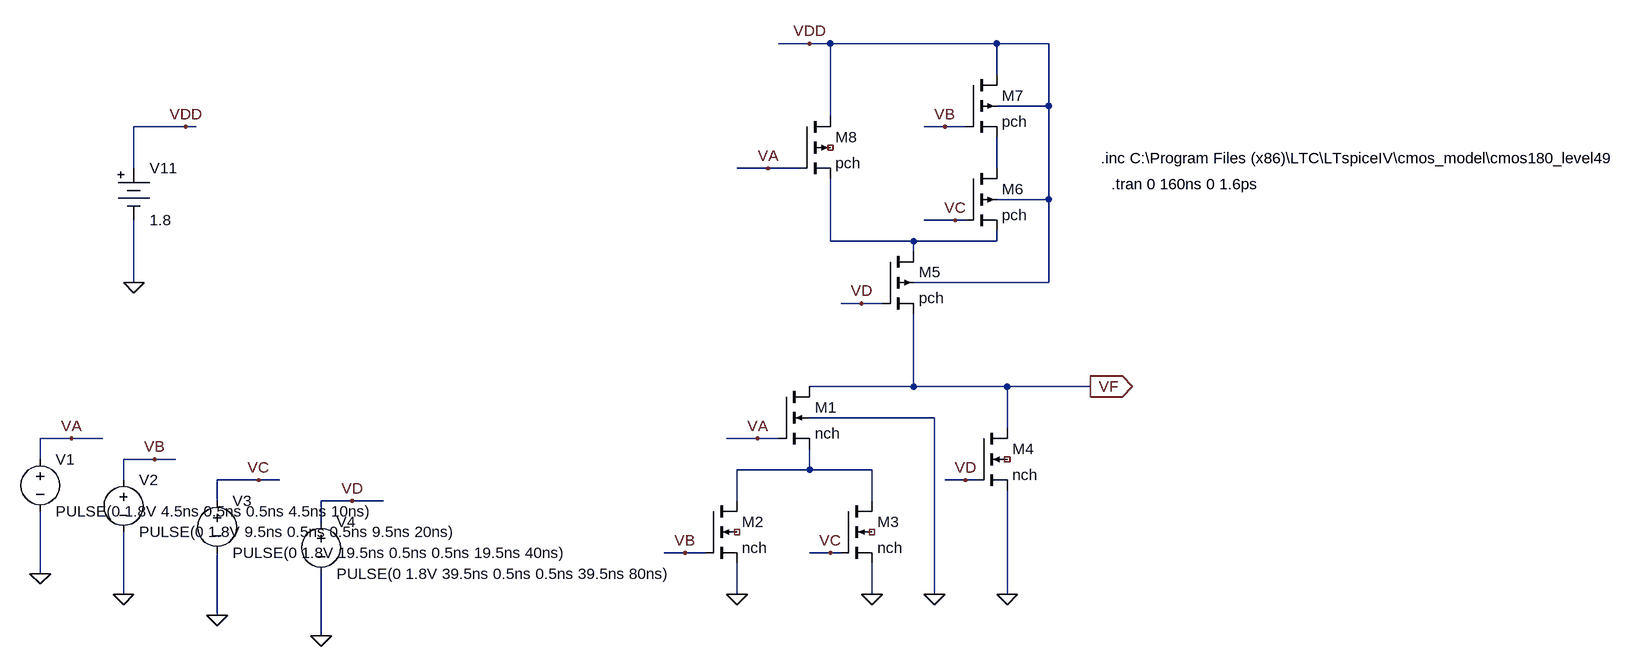
[diagram p0: schematic lab3.asc]
lab3.asc, the LTspice schematic file:
Version 4
SHEET 1 1628 948
WIRE 240 -192 192 -192
WIRE 272 -192 240 -192
WIRE 528 -192 272 -192
WIRE 608 -192 528 -192
WIRE 528 -144 528 -192
WIRE 608 -96 608 -192
WIRE 608 -96 528 -96
WIRE 272 -80 272 -192
WIRE -720 -64 -800 -64
WIRE -704 -64 -720 -64
WIRE 448 -64 416 -64
WIRE 480 -64 448 -64
WIRE -800 0 -800 -64
WIRE 176 0 128 0
WIRE 224 0 176 0
WIRE 528 0 528 -48
WIRE 608 48 608 -96
WIRE 608 48 528 48
WIRE 464 80 416 80
WIRE 480 80 464 80
WIRE 272 112 272 16
WIRE 400 112 272 112
WIRE 528 112 528 96
WIRE 528 112 400 112
WIRE 400 128 400 112
WIRE -800 176 -800 80
WIRE 608 176 608 48
WIRE 608 176 400 176
WIRE 320 208 288 208
WIRE 352 208 320 208
WIRE 400 336 400 224
WIRE 400 336 240 336
WIRE 544 336 400 336
WIRE 672 336 544 336
WIRE 432 384 240 384
WIRE 544 400 544 336
WIRE -896 416 -944 416
WIRE -848 416 -896 416
WIRE 160 416 112 416
WIRE 192 416 160 416
WIRE -944 448 -944 416
WIRE -768 448 -816 448
WIRE -736 448 -768 448
WIRE 240 464 240 432
WIRE 240 464 128 464
WIRE 336 464 240 464
WIRE -816 480 -816 448
WIRE -608 480 -672 480
WIRE -576 480 -608 480
WIRE 480 480 448 480
WIRE 496 480 480 480
WIRE -672 512 -672 480
WIRE -464 512 -512 512
WIRE -416 512 -464 512
WIRE 128 512 128 464
WIRE 336 512 336 464
WIRE -512 544 -512 512
WIRE 48 592 16 592
WIRE 80 592 48 592
WIRE 272 592 240 592
WIRE 288 592 272 592
WIRE -944 624 -944 528
WIRE -816 656 -816 560
WIRE 128 656 128 608
WIRE 336 656 336 608
WIRE 432 656 432 384
WIRE 544 656 544 496
WIRE -672 688 -672 592
WIRE -512 720 -512 624
FLAG 128 656 0
FLAG 336 656 0
FLAG 544 656 0
FLAG 240 -192 VDD
FLAG 672 336 VF
IOPIN 672 336 Out
FLAG -800 176 0
FLAG -720 -64 VDD
FLAG -896 416 VA
FLAG -768 448 VB
FLAG -608 480 VC
FLAG -464 512 VD
FLAG -944 624 0
FLAG -816 656 0
FLAG -672 688 0
FLAG 160 416 VA
FLAG 176 0 VA
FLAG 48 592 VB
FLAG 448 -64 VB
FLAG 464 80 VC
FLAG 272 592 VC
FLAG 480 480 VD
FLAG 320 208 VD
FLAG -512 720 0
FLAG 432 656 0
SYMBOL nmos4 192 336 R0
SYMATTR InstName M1
SYMATTR Value nch
SYMATTR Value2 l=0.18u w=4u
SYMBOL nmos4 80 512 R0
SYMATTR InstName M2
SYMATTR Value nch
SYMATTR Value2 l=0.18u w=4u
SYMBOL nmos4 288 512 R0
SYMATTR InstName M3
SYMATTR Value nch
SYMATTR Value2 l=0.18u w=4u
SYMBOL nmos4 496 400 R0
SYMATTR InstName M4
SYMATTR Value nch
SYMATTR Value2 l=0.18u w=4u
SYMBOL pmos4 352 128 R0
SYMATTR InstName M5
SYMATTR Value pch
SYMATTR Value2 l=0.18u w=15u
SYMBOL pmos4 480 0 R0
SYMATTR InstName M6
SYMATTR Value pch
SYMATTR Value2 l=0.18u w=15u
SYMBOL pmos4 480 -144 R0
SYMATTR InstName M7
SYMATTR Value pch
SYMATTR Value2 l=0.18u w=15u
SYMBOL pmos4 224 -80 R0
SYMATTR InstName M8
SYMATTR Value pch
SYMATTR Value2 l=0.18u w=15u
SYMBOL Misc\\battery -800 -16 R0
WINDOW 123 0 0 Left 2
WINDOW 39 0 0 Left 2
SYMATTR InstName V11
SYMATTR Value 1.8
SYMBOL voltage -944 432 R0
WINDOW 123 0 0 Left 2
WINDOW 39 0 0 Left 2
SYMATTR InstName V1
SYMATTR Value PULSE(0 1.8V 4.5ns 0.5ns 0.5ns 4.5ns 10ns)
SYMBOL voltage -816 464 R0
WINDOW 123 0 0 Left 2
WINDOW 39 0 0 Left 2
SYMATTR InstName V2
SYMATTR Value PULSE(0 1.8V 9.5ns 0.5ns 0.5ns 9.5ns 20ns)
SYMBOL voltage -672 496 R0
WINDOW 123 0 0 Left 2
WINDOW 39 0 0 Left 2
SYMATTR InstName V3
SYMATTR Value PULSE(0 1.8V 19.5ns 0.5ns 0.5ns 19.5ns 40ns)
SYMBOL voltage -512 528 R0
WINDOW 123 0 0 Left 2
WINDOW 39 0 0 Left 2
SYMATTR InstName V4
SYMATTR Value PULSE(0 1.8V 39.5ns 0.5ns 0.5ns 39.5ns 80ns)
TEXT 688 -16 Left 2 !.inc C:\\Program Files (x86)\\LTC\\LTspiceIV\\cmos_model\\cmos180_level49
TEXT 704 24 Left 2 !.tran 0 160ns 0 1.6ps

The netlist it stands for:
* lab3.asc
M1 VF VA N003 0 nch l=0.18u w=4u
M2 N003 VB 0 NC_01 nch l=0.18u w=4u
M3 N003 VC 0 NC_02 nch l=0.18u w=4u
M4 VF VD 0 NC_03 nch l=0.18u w=4u
M5 N002 VD VF VDD pch l=0.18u w=15u
M6 N001 VC N002 VDD pch l=0.18u w=15u
M7 VDD VB N001 VDD pch l=0.18u w=15u
M8 VDD VA N002 NC_04 pch l=0.18u w=15u
V11 VDD 0 1.8
V1 VA 0 PULSE(0 1.8V 4.5ns 0.5ns 0.5ns 4.5ns 10ns)
V2 VB 0 PULSE(0 1.8V 9.5ns 0.5ns 0.5ns 9.5ns 20ns)
V3 VC 0 PULSE(0 1.8V 19.5ns 0.5ns 0.5ns 19.5ns 40ns)
V4 VD 0 PULSE(0 1.8V 39.5ns 0.5ns 0.5ns 39.5ns 80ns)
.model NMOS NMOS
.model PMOS PMOS
.lib standard.mos
.inc C:\Program Files (x86)\LTC\LTspiceIV\cmos_model\cmos180_level49
.tran 0 160ns 0 1.6ps
.backanno
.end

* Results of the author's LTspice run, read from the files saved beside the schematic
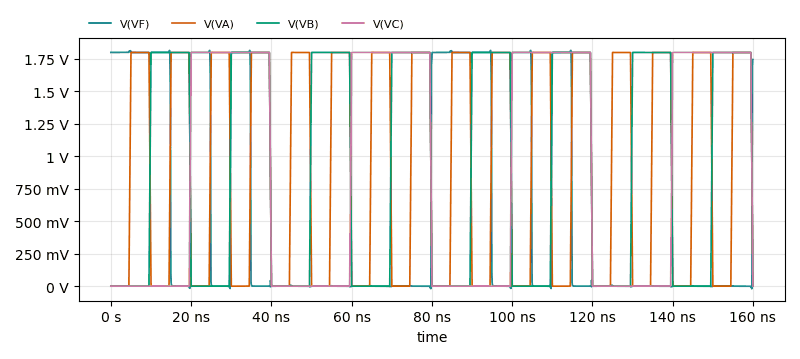
[diagram p1: Transient Analysis of lab3.asc, plotted from the saved traces]
* Transient Analysis, 1 run:
*   V(VF): min -20.19 mV, max 1.816 V, average 566.8 mV, rms 1.007 V, last 1.746 V
*   V(VA): min 0 V, max 1.8 V, average 900 mV, rms 1.251 V, last 0 V
*   V(VB): min 0 V, max 1.8 V, average 900 mV, rms 1.262 V, last 0 V
*   V(VC): min 0 V, max 1.8 V, average 900 mV, rms 1.267 V, last 0 V